# EAGLE design ampli (EAGLE 9.6.2)
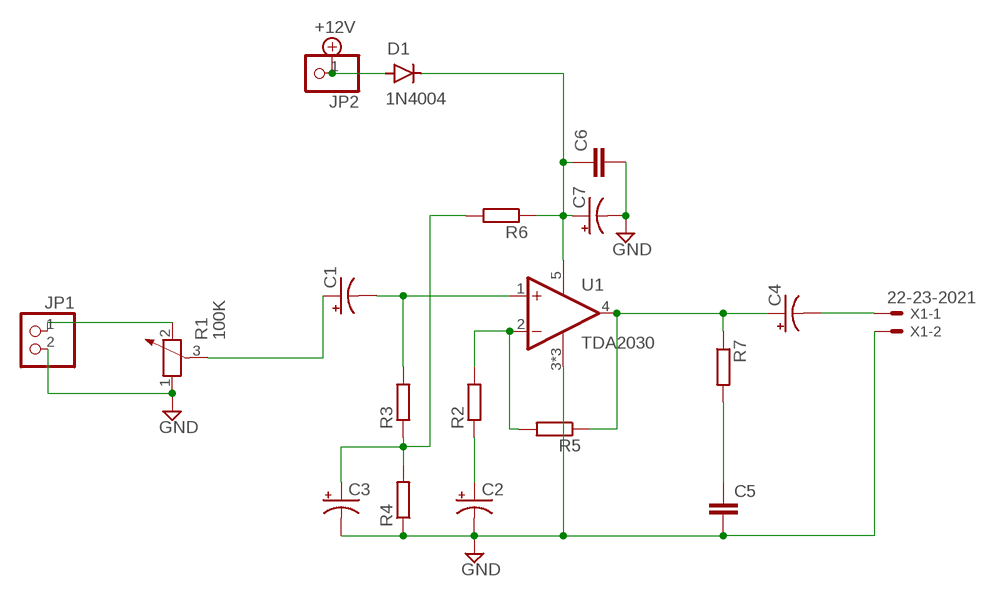
[diagram p0: schematic, sheet 1]

## Parts
C1  CPOL-USB45181A  [B45181A]
C2  CPOL-USB45181A  [B45181A]
C3  CPOL-USB45181A  [B45181A]
C4  CPOL-USB45181B  [B45181B]
C5  C-EU025-024X044  [C025-024X044]
C6  C-EU025-024X044  [C025-024X044]
C7  CPOL-USB45181B  [B45181B]
D1  1N4004  [DO-41]
JP1  PINHD-1X2  [1X02]
JP2  PINHD-1X1  [1X01]
R1  100K  POTENTIOMETER_PT-10  [PT-10]
R2  R-EU_0204/5  [0204/5]
R3  R-EU_0204/5  [0204/5]
R4  R-EU_0204/5  [0204/5]
R5  R-EU_0204/5  [0204/5]
R6  R-EU_0204/5  [0204/5]
R7  R-EU_0204/5  [0204/5]
U1  TDA2030  [TO170P1580X1040X480-5]
X1  22-23-2021  [22-23-2021]

## Nets
+12V: D1.A JP2.1
GND: C2.- C3.- C5.2 C6.2 C7.- JP1.2 R1.1 R4.1 U1.3(-VS) U1.6(-VS) U1.6.1(-VS) X1.2
N$1: C1.- R3.2 U1.1(NON_INV_INPUT)
N$2: C4.- X1.1
N$3: C3.+ R3.1 R4.2 R6.2
N$4: JP1.1 R1.2
N$5: R2.2 R5.2 U1.2(INV_INPUT)
N$6: C4.+ R5.1 R7.1 U1.4(OUTPUT)
N$7: C2.+ R2.1
N$8: C5.1 R7.2
N$9: C6.1 C7.+ D1.C R6.1 U1.5(+VS)
N$10: C1.+ R1.3

## Library data of the parts
C1-C4 C7 = rcl:CPOL-US: POLARIZED CAPACITOR, American symbol; SPICEPREFIX: C
C5 C6 = rcl:C-EU: CAPACITOR, European symbol; SPICEPREFIX: C
D1 = Diodes:1N4004: DIODE GEN PURP 400V 1A DO41 Manufacturer's datasheet <https://www.mccsemi.com/pdf/Products/1N4001-1N4007(DO-41).pdf>; CREATED_BY: PCBLayout.com; DIGIKEY_PART_NUMBER: 1N4004MSCT-ND; MANUFACTURER: Micro Commercial Co; MPN: 1N4004; PACKAGE: DO-41
JP1 = pinhead:PINHD-1X2: PIN HEADER
JP2 = pinhead:PINHD-1X1: PIN HEADER
R1 = rcl:POTENTIOMETER_: Potentiometer; SPICEMODEL: POT; SPICEPREFIX: X
R2-R7 = rcl:R-EU_: RESISTOR, European symbol; SPICEPREFIX: R
U1 = TDA2030:TDA2030: 14 W hi-fi audio amplifier Check availability <https://pricing.snapeda.com/parts/TDA2030/STMicroelectronics/view-part?ref=eda>; AVAILABILITY: In Stock; DESCRIPTION: Amplifier IC 1-Channel (Mono) Class AB 5-PENTAWATT; MF: STMicroelectronics; MP: TDA2030; PACKAGE: Pentawatt-5 STMicroelectronics; PRICE: None
X1 = con-molex:22-23-2021: .100" (2.54mm) Center Header - 2 Pin; MF: MOLEX; MPN: 22-23-2021; OC_FARNELL: 1462926; OC_NEWARK: 25C3832

## Board
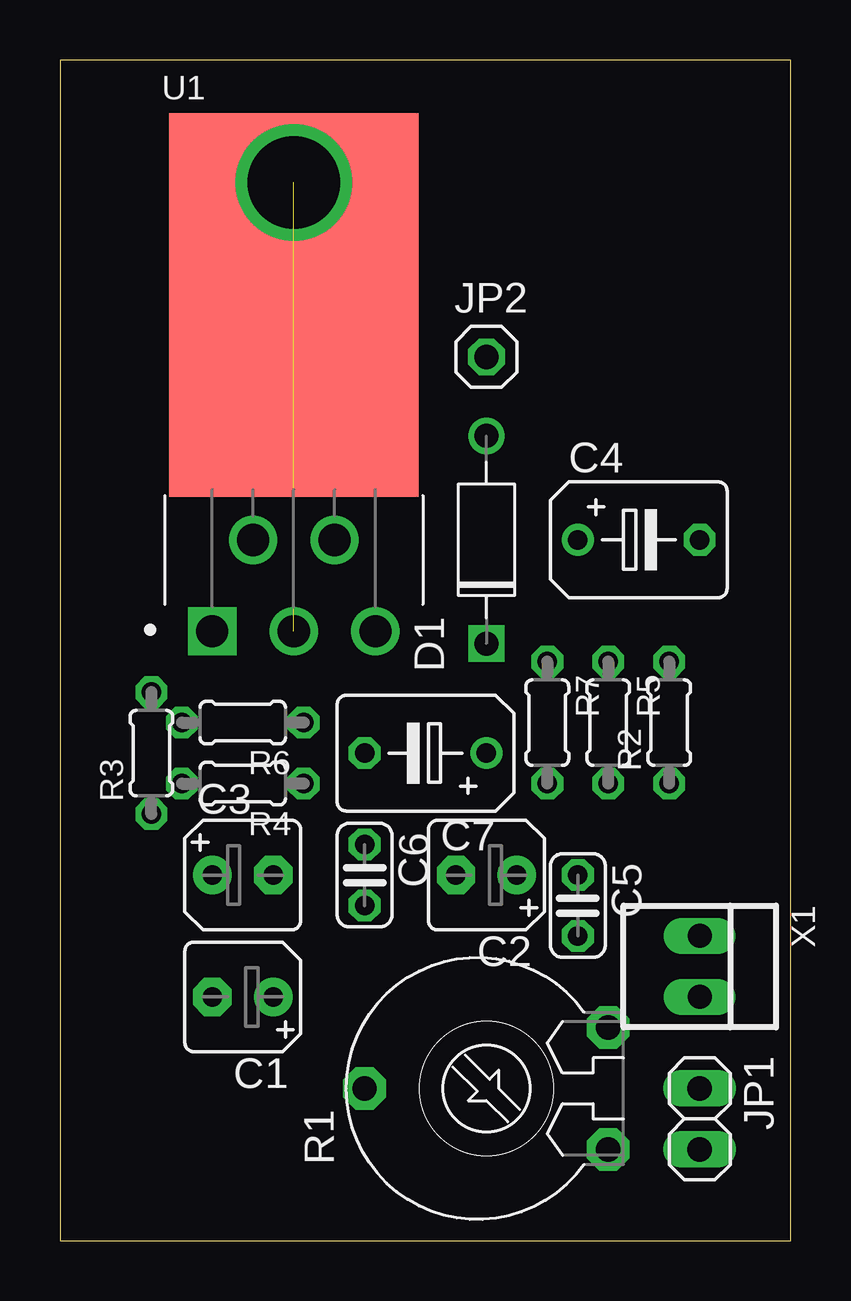
[diagram p1: board, top side]
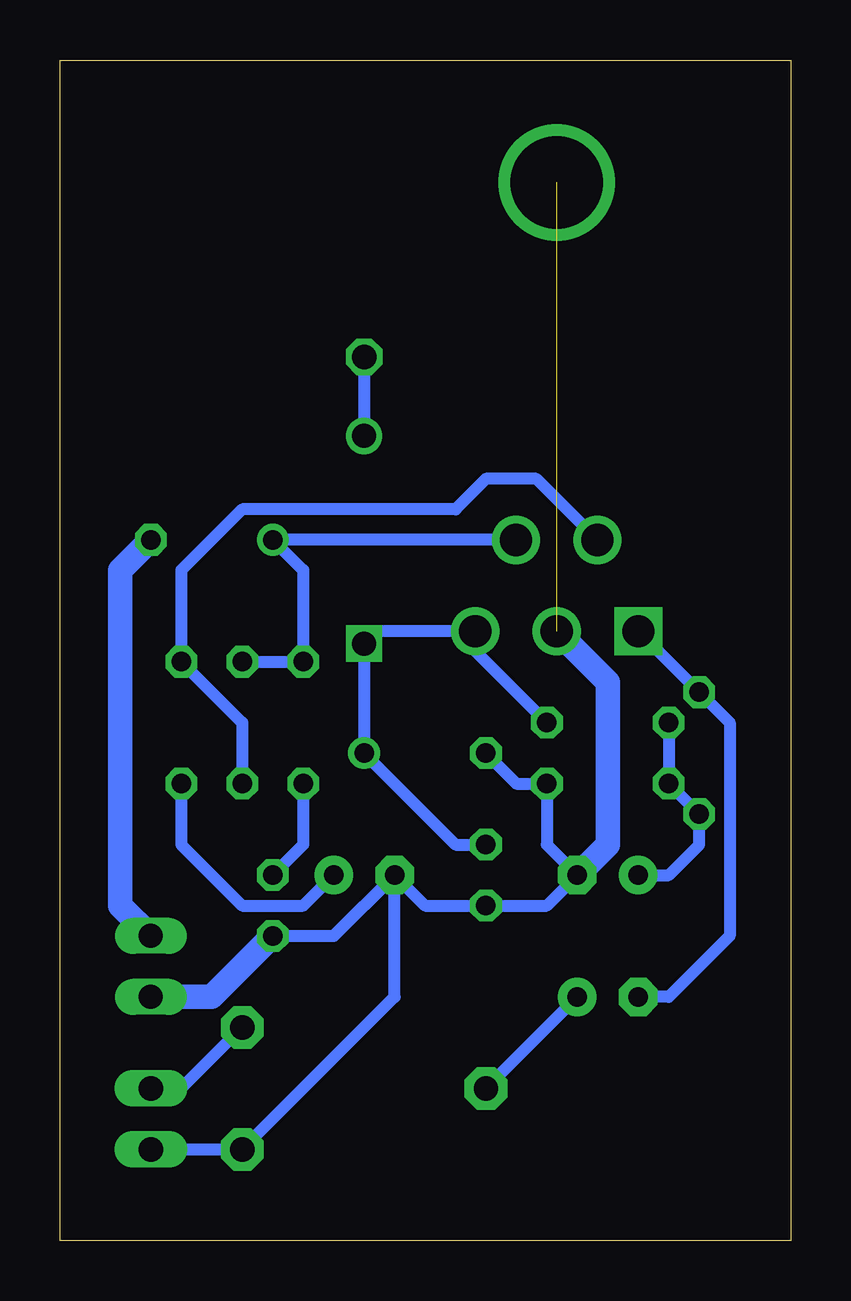
[diagram p2: board, bottom side, seen from below]

Size 30.46 x 49.2 mm. Coordinates in mm from the lower left corner, seen from the top.
Outline: 0,0 30.46,0 30.46,49.2 0,49.2 0,0
Copper layers (1*16): Top 0.035mm / dielectric 1.5mm / Bottom 0.035mm
Design rules "default": minimum track width 6mil, minimum drill 0.35mm, track to track 6mil, track to pad 6mil, pad to pad 6mil, via to via 6mil, smd to smd 6mil, copper to edge 40mil, drill to drill 6mil, minimum pad ring 10mil, minimum via ring 8mil, stop-mask expansion 4mil, vias tented up to drill 0mil, thermal gap 10mil

### Footprints (pad centres in the part's own frame; a part is rotated, then mirrored left to right if it is on the bottom)
B45181A = drill 0.813 pad 1.6: + -1.27,0 | drill 0.813 pad 1.6 octagon: - 1.27,0
B45181B = drill 0.813: + -2.54,0 | drill 0.813 octagon: - 2.54,0
C025-024X044 = drill 0.813 octagon: 1 -1.27,0; 2 1.27,0
DO-41 = drill 1: A 4.325,0 | drill 1 square: C -4.325,0
1X02 = drill 1.016 long: 1 -1.27,0; 2 1.27,0
1X01 = drill 1.016 octagon: 1 0,0
PT-10 = drill 1.016 pad 1.778 octagon: 1 -2.54,-5.08; 2 2.54,-5.08; 3 0,5.08
0204/5 = drill 0.813 octagon: 1 -2.54,0; 2 2.54,0
TO170P1580X1040X480-5 = drill 1.34 pad 2.01 square: 1 0,0 | drill 1.34 pad 2.01: 2 1.7,3.8; 3 3.4,0; 4 5.1,3.8; 5 6.8,0 | smd 10.4 x 15.99: 6 3.4,13.593 | drill 3.85: 6.1 3.4,18.7
22-23-2021 = drill 1 long: 1 -1.27,0; 2 1.27,0

### Placement (x,y rotation side)
C1  7.62,10.16 180 top
C2  17.78,15.24 180 top
C3  7.62,15.24 0 top
C4  24.13,29.21 0 top
C5  21.59,13.97 270 top
C6  12.7,15.24 270 top
C7  15.24,20.32 180 top
D1  17.78,29.21 90 top
JP1  26.67,5.08 270 top
JP2  17.78,36.83 0 top
R1  17.78,6.35 90 top
R2  25.4,21.59 90 top
R3  3.81,20.32 90 top
R4  7.62,19.05 180 top
R5  22.86,21.59 270 top
R6  7.62,21.59 180 top
R7  20.32,21.59 270 top
U1  6.35,25.4 0 top
X1  26.67,11.43 270 top

### Tracks (layer width: path | path; a pad name or v marks a point on that pad's centre or on a via)
+12V
  Bottom 0.508: JP2.1 D1.A
GND  (2 unrouted)
  Bottom 0.508: C7.- 11.43,19.05 R4.1 10.16,16.51 C3.- 10.16,13.97 C6.2 15.24,13.97 C2.- | C5.2 19.05,12.7 C2.- | C2.- 16.51,10.16 R1.1 JP1.2
  Bottom 1.016: U1.3 7.62,23.27 7.62,16.51 C3.- | X1.2 24.13,10.16 C5.2
N$1
  Bottom 0.508: U1.1 R3.2 2.54,21.59 2.54,12.7 5.08,10.16 C1.-
N$2
  Bottom 1.016: C4.- 27.94,27.94 27.94,13.97 X1.1
N$3
  Bottom 0.508: C3.+ 5.08,15.24 3.81,16.51 R3.1 R4.2 R6.2
N$4
  Bottom 0.508: JP1.1 25.4,6.35 R1.2
N$5
  Bottom 0.508: R5.2 22.86,21.59 R2.2 25.4,27.94 22.86,30.48 13.97,30.48 12.7,31.75 10.6,31.75 U1.2
N$6
  Bottom 0.508: U1.4 C4.+ 20.32,27.94 R7.1 R5.1
N$7
  Bottom 0.508: R2.1 25.4,16.51 22.86,13.97 20.32,13.97 C2.+
N$8
  Bottom 0.508: R7.2 20.32,16.51 C5.1
N$9
  Bottom 0.508: R6.1 13.15,24.58 U1.5 17.26,25.4 D1.C C7.+ 13.97,16.51 C6.1
N$10
  Bottom 0.508: C1.+ R1.3